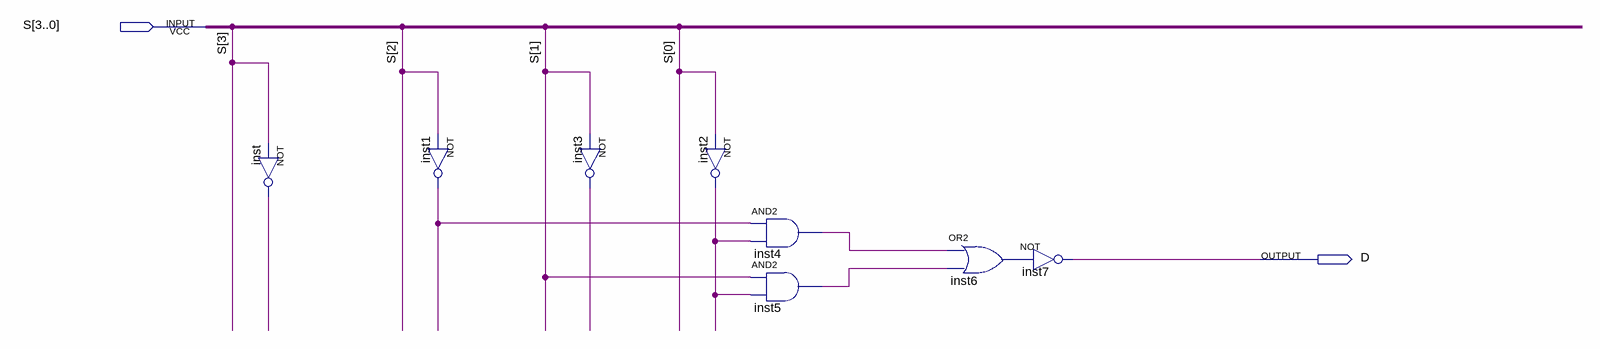
[diagram p0: schematic sheet]
// Quartus schematic DisplayD.bdf as structural Verilog: 8 symbols, 2 pins
module DisplayD (
  input  [3:0] S,
  output D
);

  wire inst1_out, inst2_out, inst3_out, inst4_out, inst5_out, inst6_out, inst_out;

  not inst (inst_out, S[3]);
  not inst1 (inst1_out, S[2]);
  not inst3 (inst3_out, S[1]);
  not inst2 (inst2_out, S[0]);
  and inst4 (inst4_out, inst1_out, inst2_out);
  and inst5 (inst5_out, S[1], inst2_out);
  or inst6 (inst6_out, inst4_out, inst5_out);
  not inst7 (D, inst6_out);
endmodule
